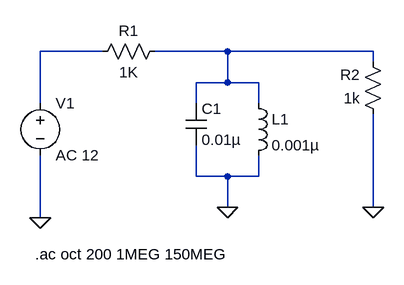
[diagram p0: schematic FilterR.asc]
FilterR.asc, the LTspice schematic file:
Version 4
SHEET 1 880 680
WIRE -16 96 -112 96
WIRE 176 96 64 96
WIRE 400 96 176 96
WIRE 400 112 400 96
WIRE 176 144 176 96
WIRE 176 144 128 144
WIRE 224 144 176 144
WIRE -112 176 -112 96
WIRE 128 176 128 144
WIRE 224 176 224 144
WIRE 128 288 128 240
WIRE 176 288 128 288
WIRE 224 288 224 256
WIRE 224 288 176 288
WIRE 176 336 176 288
WIRE 400 336 400 192
WIRE -112 352 -112 256
FLAG 176 336 0
FLAG 400 336 0
FLAG -112 352 0
SYMBOL res 80 80 R90
WINDOW 0 0 56 VBottom 2
WINDOW 3 32 56 VTop 2
SYMATTR InstName R1
SYMATTR Value 1K
SYMBOL res 416 208 R180
WINDOW 0 36 76 Left 2
WINDOW 3 36 40 Left 2
SYMATTR InstName R2
SYMATTR Value 1k
SYMBOL ind 208 160 R0
SYMATTR InstName L1
SYMATTR Value 0.001µ
SYMBOL cap 112 176 R0
SYMATTR InstName C1
SYMATTR Value 0.01µ
SYMBOL voltage -112 160 R0
SYMATTR InstName V1
SYMATTR Value AC 12
TEXT -120 408 Left 2 !.ac oct 200 1MEG 150MEG

The netlist it stands for:
* FilterR.asc
R1 N002 N001 1K
R2 0 N002 1k
L1 N002 0 0.001µ
C1 N002 0 0.01µ
V1 N001 0 AC 12
.ac oct 200 1MEG 150MEG
.backanno
.end